# EAGLE design untitled (EAGLE 9.5.0)
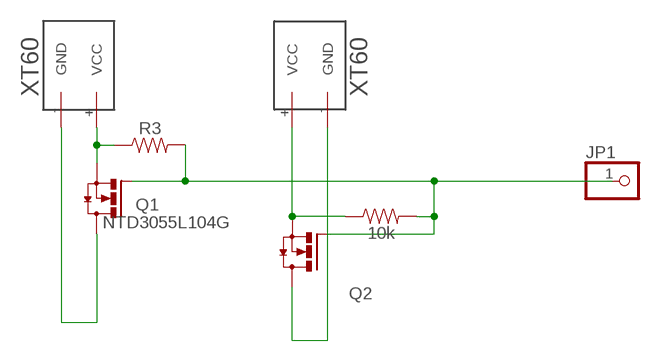
[diagram p0: schematic, sheet 1]

## Parts
JP1  PINHD-1X1  [1X01]
Q1  NTD3055L104G  [DPAK4]
Q2  NTD3055L104G  [DPAK4]
R3  10k  10KOHM-0402-1/16W-1%  [0402]
R4  10k  10KOHM-0402-1/16W-1%  [0402]
U$1  XT60  [XT60]
U$2  XT60  [XT60]

## Nets
N$1: Q1.3(S) R3.1 U$1.+(VCC)
N$3: Q1.2(D) Q1.4(D) U$1.-(GND)
N$4: Q2.2(D) Q2.4(D) U$2.-(GND)
N$5: Q2.3(S) R4.1 U$2.+(VCC)
N$7: JP1.1 Q1.1(G) Q2.1(G) R3.2 R4.2

## Library data of the parts
JP1 = adafruit:PINHD-1X1: Pin header 1x1 for 0.1" spacing With round pins
Q1 Q2 = Transistor:NTD3055L104G: 12 A, 60 V, Logic Level N−Channel DPAK/IPAK Manufacturer's datasheet <https://www.onsemi.com/pub/Collateral/NTD3055L104-D.PDF>; CREATED_BY: PCBLayout.com; MANUFACTURER: ON SEMICONDUCTORS; MPN: NTD3055L104G; PACKAGE: DPAK-4
R3 R4 = SparkFun-Resistors:10KOHM: 10kΩ resistor A resistor is a passive two-terminal electrical component that implements electrical resistance as a circuit element. Resistors act to reduce current flow, and, at the same time, act to lower voltage levels within circuits. - Wikipedia; PROD_ID: RES-14241
U$1 U$2 = XT60:XT60: XT60

## Board
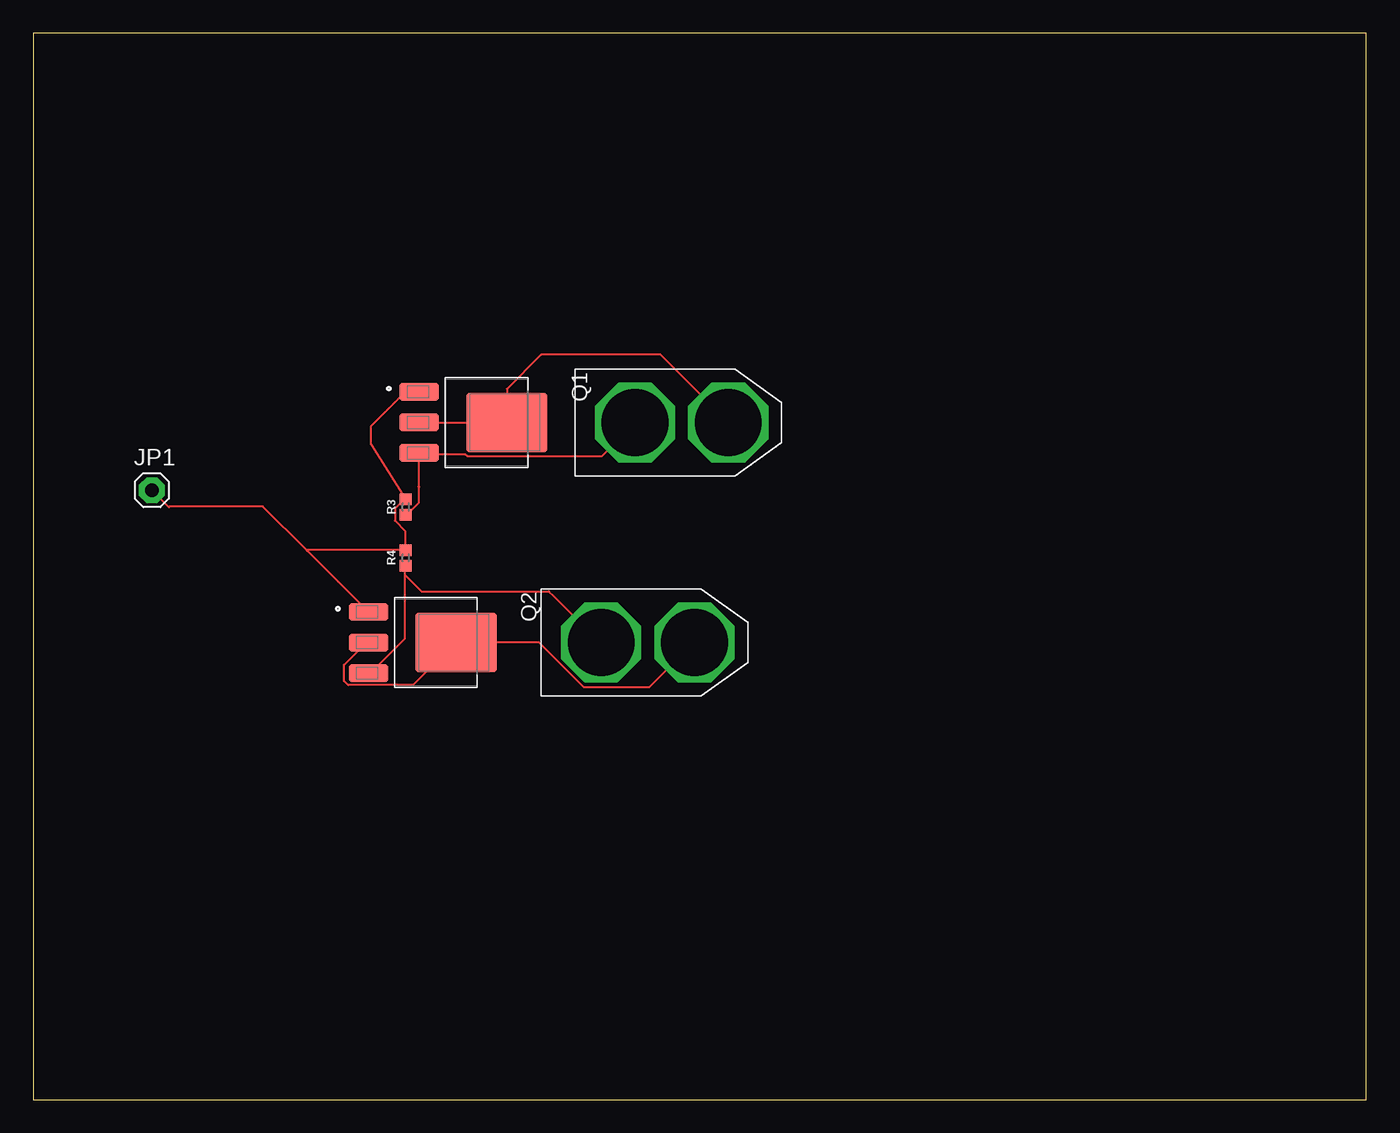
[diagram p1: board, top side]

Size 100 x 80 mm. Coordinates in mm from the lower left corner, seen from the top.
Outline: 0,0 100,0 100,80 0,80 0,0
Copper layers (1*16): Top 0.035mm / dielectric 1.5mm / Bottom 0.035mm
Design rules "default": minimum track width 6mil, minimum drill 0.35mm, track to track 6mil, track to pad 6mil, pad to pad 6mil, via to via 6mil, smd to smd 6mil, copper to edge 40mil, drill to drill 6mil, minimum pad ring 10mil, minimum via ring 8mil, stop-mask expansion 4mil, vias tented up to drill 0mil, thermal gap 10mil

### Footprints (pad centres in the part's own frame; a part is rotated, then mirrored left to right if it is on the bottom)
1X01 = drill 1.016 pad 1.93 octagon: 1 0,0
DPAK4 = smd 1.36 x 2.98: 1 -2.29,-4.07; 2 0,-4.07; 3 2.29,-4.07 | smd 4.49 x 6.1: 4 0,2.51
0402 = smd 0.85 x 0.9: 1 -0.58,0; 2 0.58,0
XT60 = drill 5 octagon: + 4.5,0; - 11.5,0

### Placement (x,y rotation side)
JP1  8.89,45.72 0 top
Q1  33.02,50.8 270 top
Q2  29.21,34.29 270 top
R3  27.94,44.45 90 top
R4  27.94,40.64 90 top
U$1  40.64,50.8 0 top
U$2  38.1,34.29 0 top

### Tracks (layer width: path | path; a pad name or v marks a point on that pad's centre or on a via)
N$1
  Top 0.152: R3.1 28.04,43.89 28.91,44.76 28.91,45.97 28.95,45.98 Q1.3 29.06,48.41 32.41,48.41 32.56,48.26 42.62,48.26 45.06,50.7 U$1.+
N$3
  Top 0.152: U$1.- 47.06,55.88 38.1,55.88 35.53,53.31 Q1.4 Q1.2
N$4
  Top 0.152: Q2.2 24.99,34.29 23.32,32.61 23.32,31.39 23.62,31.09 28.5,31.09 31.7,34.29 Q2.4 37.95,34.29 41.3,30.94 46.18,30.94 49.53,34.29 U$2.-
N$5
  Top 0.152: 27.89,39.37 27.89,34.59 25.15,31.85 Q2.3 | 27.89,39.37 27.89,39.93 R4.1 | 38.71,38.1 38.66,38.15 | U$2.+ 42.52,34.29 39.04,37.77 38.71,38.1 | 27.89,39.37 29.16,38.1 38.71,38.1
N$7
  Top 0.152: 22.86,38.86 Q2.1 | 20.57,41.15 22.86,38.86 | JP1.1 10.16,44.45 10.21,44.5 17.22,44.5 20.5,41.22 | 27.89,45.11 27.13,44.35 27.13,43.43 27.89,42.67 27.89,41.3 R4.2 | 27.89,41.15 R4.2 | 20.5,41.22 22.86,38.86 | 27.89,45.11 25.35,49.13 25.35,50.55 27.89,53.09 Q1.1 | 27.89,45.11 R3.2 | R4.2 20.5,41.22